# EAGLE design FETSwitch (EAGLE 6.3)
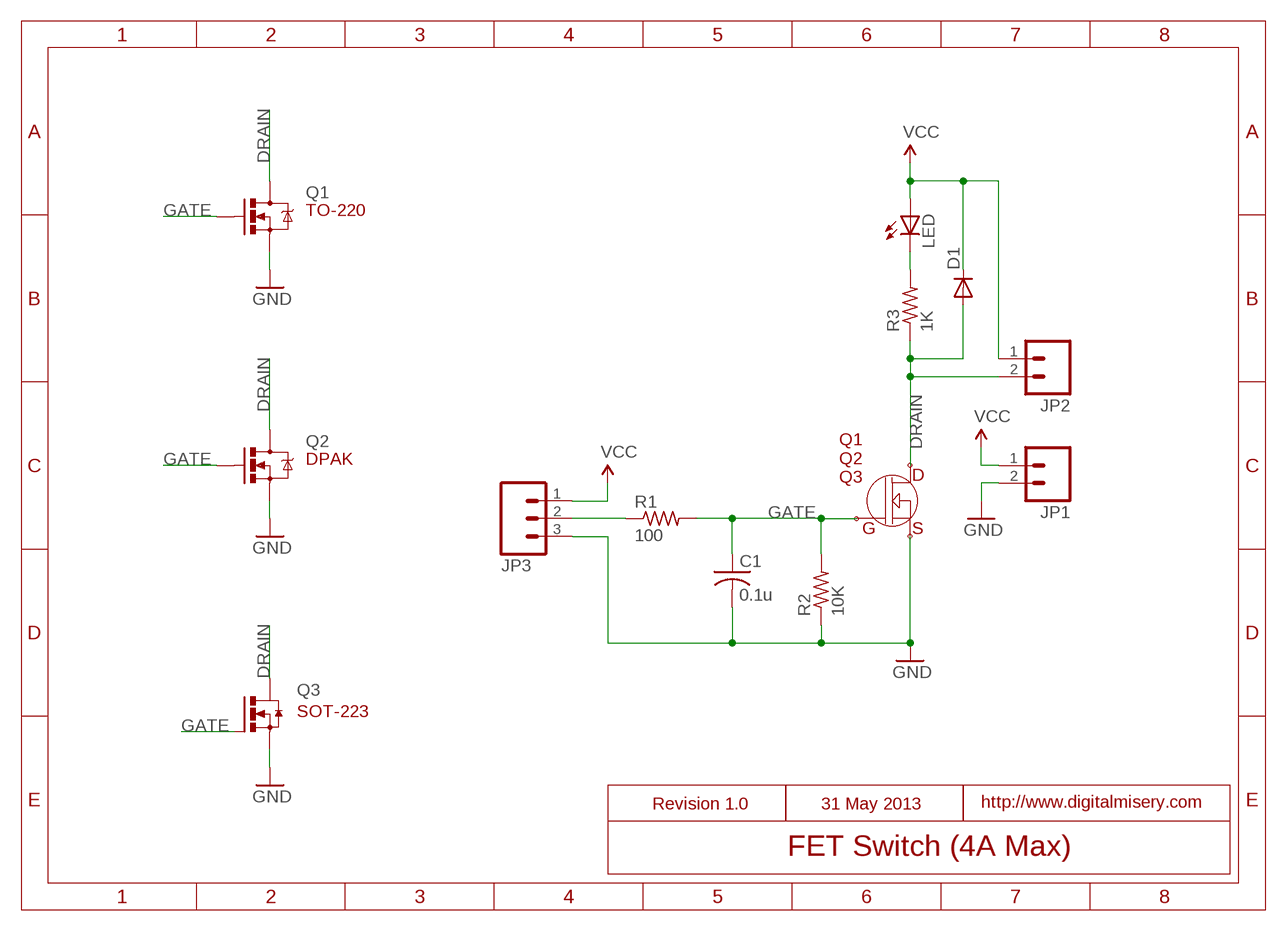
[diagram p0: schematic, sheet 1]

## Parts
C1  0.1u  C-USC0805K  [C0805K]
D1  DIODESMA  [SMA-DIODE]
JP1  M02PTH3  [1X02_LONGPADS]
JP2  M02PTH3  [1X02_LONGPADS]
JP3  M03LONGPADS  [1X03_LONGPADS]
LED  LEDCHIP-LED0805  [CHIP-LED0805]
Q1  MOSFET-NCHANNELFQP30N06L  [TO220V]
Q2  MOSFET-NCHANNELFDD8780  [DPAK]
Q3  N-HEXFET-2D_SOT232-  [SOT223]
R1  100  R-US_R0805  [R0805]
R2  10K  R-US_R0805  [R0805]
R3  1K  R-US_R0805  [R0805]

## Nets
DRAIN: D1.A JP2.2 Q1.2(D) Q2.4(D) Q3.2(D) Q3.4(D) R3.1
GATE: C1.1 Q1.1(G) Q2.1(G) Q3.1(G) R1.2 R2.2
GND: C1.2 JP1.2 JP3.3 Q1.3(S) Q2.3(S) Q3.3(S) R2.1
N$1: LED.C R3.2
N$4: JP3.2 R1.1
VCC: D1.C JP1.1 JP2.1 JP3.1 LED.A

## Notes on the sheet
- TO-220
- DPAK
- D
- Q1
  Q2
  Q3
- G | S
- SOT-223
- Revision 1.0 | 31 May 2013 | http://www.digitalmisery.com
- FET Switch (4A Max)

## Library data of the parts
C1 = adafruit:C-US: CAPACITOR, American symbol
D1 = SparkFun-DiscreteSemi:DIODE: Diode These are standard reverse protection diodes and small signal diodes. SMA package can handle up to about 1A. SOD-323 can handle about 200mA. What the SOD-323 package when ordering, there are some mfgs out there that are 5-pin packages.
JP1 JP2 = SparkFun-Connectors:M02: Header 2 Standard 2-pin 0.1" header. Use with straight break away headers (SKU : PRT-00116), right angle break away headers (PRT-00553), swiss pins (PRT-00743), machine pins (PRT-00117), and female headers (PRT-00115). Molex polarized connector foot print use with SKU : PRT-08233 with associated crimp pins and housings.
JP3 = SparkFun-Connectors:M03: Header 3 Standard 3-pin 0.1" header. Use with straight break away headers (SKU : PRT-00116), right angle break away headers (PRT-00553), swiss pins (PRT-00743), machine pins (PRT-00117), and female headers (PRT-00115). Molex polarized connector foot print use with SKU : PRT-08232 with associated crimp pins and housings.
LED = adafruit:LED: LED OSRAM: - CHIPLED LG R971, LG N971, LY N971, LG Q971, LY Q971, LO R971, LY R971 LH N974, LH R974 LS Q976, LO Q976, LY Q976 LO Q996 - Hyper CHIPLED LW Q18S LB Q993, LB Q99A, LB R99A - SideLED LS A670, LO A670, LY A670, LG A670, LP A670 LB A673, LV A673, LT A673, LW A673 LH A674 LY A675 LS A676, LA A676, LO A676, LY A676, LW A676 LS A679, LY A679, LG A679 - Hyper Micro SIDELED® LS Y876, LA Y876, LO Y876, LY Y876 LT Y87S - SmartLED LW L88C, LW L88S LB L89C, LB L89S, LG L890 LS L89K, LO L89K, LY L89K LS L896, LA L896, LO L896, LY L896 - TOPLED LS T670, LO T670, LY T670, LG T670, LP T670 LSG T670, LSP T670, LSY T670, LOP T670, LYG T670 LG T671, LOG T671, LSG T671 LB T673, LV T673, LT T673, LW T673 LH T674 LS T676, LA T676, LO T676, LY T676, LB T676, LH T676, LSB T676, LW T676 LB T67C, LV T67C, LT T67C, LS T67K, LO T67K, LY T67K, LW E67C LS E67B, LA E67B, LO E67B, LY E67B, LB E67C, LV E67C, LT E67C LW T67C LS T679, LY T679, LG T679 LS T770, LO T770, LY T770, LG T770, LP T770 LB T773, LV T773, LT T773, LW T773 LH T774 LS E675, LA E675, LY E675, LS T675 LS T776, LA T776, LO T776, LY T776, LB T776 LHGB T686 LT T68C, LB T68C - Hyper Mini TOPLED® LB M676 - Mini TOPLED Santana® LG M470 LS M47K, LO M47K, LY M47K Source: http://www.osram.convergy.de/
Q1 = SparkFun-DiscreteSemi:MOSFET-NCHANNEL: Common NMOSFET Parts MFG P/N Store ID Prod ID FDD8780 TRANS-09984 SI7820DN TRANS-11055 FDS6630A IC-08089 2N7002PW TRANS-11151 FQP30N06L COM-10213 TRANS-10060 BSS123LT1G TRANS-08345 BSS138 TRANS-00830 BS170 2N7000; PROD_ID: TRANS-10060
Q2 = SparkFun-DiscreteSemi:MOSFET-NCHANNEL: Common NMOSFET Parts MFG P/N Store ID Prod ID FDD8780 TRANS-09984 SI7820DN TRANS-11055 FDS6630A IC-08089 2N7002PW TRANS-11151 FQP30N06L COM-10213 TRANS-10060 BSS123LT1G TRANS-08345 BSS138 TRANS-00830 BS170 2N7000; PROD_ID: TRANS-09984
Q3 = transistor-power:N-HEXFET-2D_?-*: HEXFET® Power MOSFET 2 Drain connects http://www.irf.com/product-info/datasheets/data/irll014n.pdf
R1-R3 = adafruit:R-US_: RESISTOR, American symbol

## Board
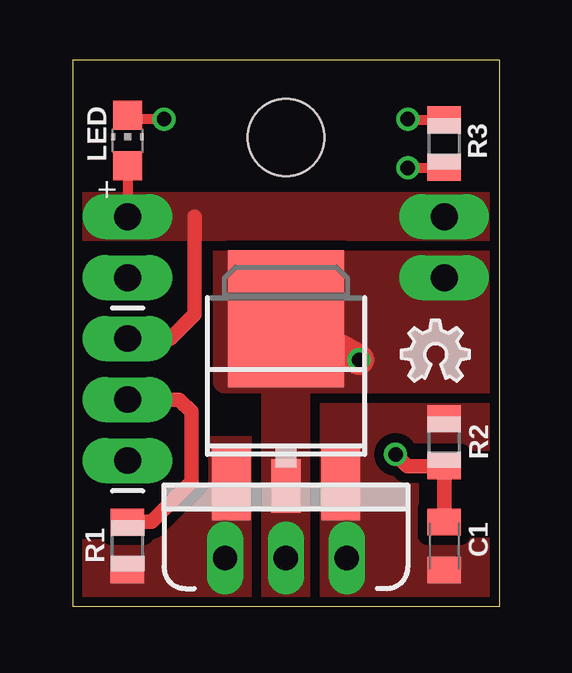
[diagram p1: board, top side]
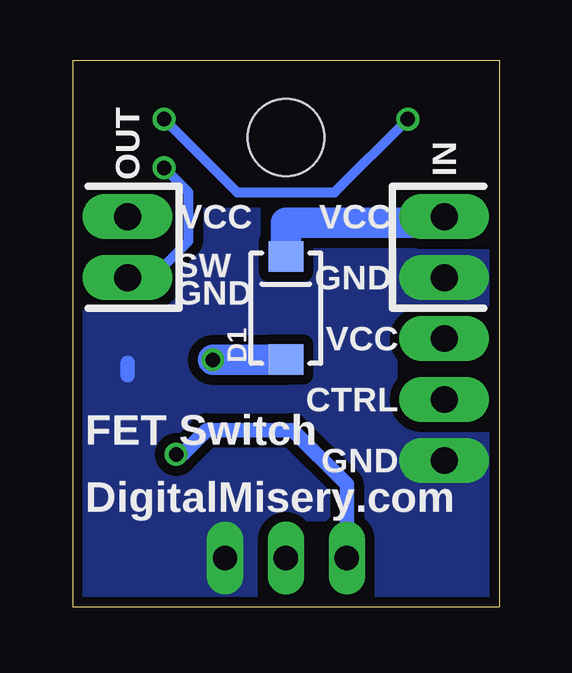
[diagram p2: board, bottom side, seen from below]

Size 17.78 x 22.78 mm. Coordinates in mm from the lower left corner, seen from the top.
Outline: 17.78,22.78 17.78,0 0,0 0,22.78 17.78,22.78
Copper layers (1*16): Top 0.0356mm / dielectric 1.5011mm / Bottom 0.0356mm
Design rules "LaenPCBOrder *": minimum track width 10mil, minimum drill 15mil, track to track 12mil, track to pad 12mil, pad to pad 12mil, via to via 12mil, smd to smd 8mil, copper to edge 15mil, drill to drill 10mil, minimum pad ring 7mil, minimum via ring 7mil, stop-mask expansion 4mil, vias tented up to drill 25mil, thermal gap 12mil
Holes 3.2 mm at 8.89,19.56

### Footprints (pad centres in the part's own frame; a part is rotated, then mirrored left to right if it is on the bottom)
C0805K = smd 1.1 x 1.4: 1 -1,0; 2 1,0
SMA-DIODE = smd 1.27 x 1.47: A -2.15,0; C 2.15,0
1X02_LONGPADS = drill 1.118 pad 1.88 long: 1 0,0; 2 2.54,0
1X03_LONGPADS = drill 1.118 pad 1.88 long: 1 0,0; 2 2.54,0; 3 5.08,0
CHIP-LED0805 = smd 1.2 x 1.2: A 0,-1.05; C 0,1.05
TO220V = drill 1.016 long: 1 -2.54,0; 2 0,0; 3 2.54,0
DPAK = smd 1.6 x 3: 1 -2.28,-5.31; 3 2.28,-5.31 | smd 4.826 x 5.715: 4 0,1.588
SOT223 = smd 1.219 x 2.235: 1 -2.311,-3.099; 2 0,-3.099; 3 2.311,-3.099 | smd 3.6 x 2.2: 4 0,3.099
R0805 = smd 1.1 x 1.4: 1 -1,0; 2 1,0

### Placement (x,y rotation side)
C1  15.49,2.54 270 top
D1  8.89,12.45 90 bottom
JP1  2.29,16.26 270 top
JP2  15.49,16.26 270 top
JP3  2.29,11.18 270 top
LED  2.29,19.43 0 top
Q1  8.89,2.03 0 top
Q2  8.89,10.41 0 top
Q3  8.89,8.13 0 top
R1  2.29,2.54 270 top
R2  15.49,6.86 270 top
R3  15.49,19.3 90 top
U$2  [OSHW_FILLX100_NOTEXT]  13.72,9.4 0 top

### Tracks (layer width: path | path; a pad name or v marks a point on that pad's centre or on a via)
DRAIN  (via drill 0.6)
  Top 0.406: v13.97,18.29 15.73,18.29 R3.1
  Top 1.27: v11.94,10.29 Q2.4
  Bottom 0.406: JP2.2 14.48,13.72 12.95,15.24 12.95,17.27 v13.97,18.29
  Bottom 1.27: v11.94,10.29 8.89,10.29 D1.A
  pour Top (isolate 0.406, rank 2, no thermals): 8.38,0 8.38,9.4 6.35,9.4 6.35,15.24 11.43,15.24 11.43,14.73 17.78,14.73 17.78,9.4 9.4,9.4 9.4,0
GATE  (via drill 0.6)
  Top 0.61: 6.35,5.1 Q2.1 | C1.1 R2.2 13.95,5.86 v13.46,6.35
  Bottom 0.61: v13.46,6.35 13.21,6.35 12.19,7.37 8.62,7.37 6.35,5.1 Q1.1
  pour Top (isolate 0.406, rank 4, no thermals): 0,6.6 7.37,6.6 7.37,0 0,0
GND
  Bottom 0.61: 15.49,9.65 15.49,10.16
  pour Bottom (isolate 0.406, no thermals): 0,0 0,16.13 17.78,16.13 17.78,0
  pour Top (isolate 0.406, rank 3, no thermals): 10.54,0 10.54,9.27 17.78,9.27 17.78,0
N$1  (via drill 0.6)
  Top 0.406: v13.97,20.32 13.99,20.3 R3.2 | v3.81,20.32 2.07,20.32 LED.C
  Bottom 0.406: v13.97,20.32 10.92,17.27 6.86,17.27 v3.81,20.32
N$4
  Top 0.61: R1.1 3.29,3.54 4.95,5.21 4.95,8.13 4.45,8.64 JP3.2
VCC
  Top 0.406: LED.A JP1.1
  Top 0.61: JP3.1 4.06,11.18 5.08,12.19 5.08,16.26
  Bottom 1.27: D1.C 8.89,16 2.54,16 JP1.1
  pour Top (isolate 0.406, no thermals): 0,16.76 17.78,16.76 17.78,15.75 0,15.75

### Text on the board
bPlace: IN | OUT | VCC | VCC | GND | SW | GND | VCC | CTRL | FET Switch | GND | DigitalMisery.com